# EasyEDA Pro project LuxcampBadge2025.epro, board LED
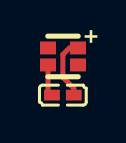
[diagram p5: board, top side]
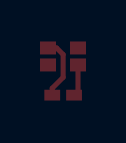
[diagram p6: board, bottom side, seen from below]

No outline. copper layers: Top Layer, Bottom Layer. Coordinates in mm from the lowest, leftmost part position.
Stack: Top Layer 0.035mm / Dielectric1 1.51mm FR4 er 4.5 / Bottom Layer 0.035mm

## Design rules (mm)
template: JLCPCB Capability(Two Layers Board)
spacing copperThickness1oz (default): track to track 0.102, other pairs 0.152 to 0.3
spacing copperThickness2oz: track to track 0.203, other pairs 0.152 to 0.3
track width copperThickness1oz (default): min 0.127, default 0.254, max 2.54
track width copperThickness2oz: min 0.203, default 0.254, max 2.54
differential pair differentialPair (default): width min 0.127, default 0.254, max 2.54; gap min 0.152, default 0.152
via viaSize (default): diameter min 0.5, default 0.61, max 10; hole min 0.3, default 0.305, max 6.3

## Placement (name value [footprint] x y rotation side)
C1  100nF  [C0402]  0 0 180 top
LED1  XL-1615RGBC-WS2812B-S  [LED-SMD_4P-L1.6-W1.5_XL-1615RGBC-WS2812B-S]  0.01 1.94 0 top

## Footprints (pads in the part's own frame, mm; a bottom-side part is the same pattern mirrored in y, then rotated)
C0402
  rect 0.79x0.54 smd: 1(-0.545,0) 2(0.545,0)
LED-SMD_4P-L1.6-W1.5_XL-1615RGBC-WS2812B-S
  rect 0.8x0.65 smd: 1(-0.75,0.425) 2(0.75,0.425) 3(-0.75,-0.425) 4(0.75,-0.425)

## Nets
GND: C1.2 LED1.3
LED_IN: LED1.4
LED_OUT: LED1.1
LED_VCC: C1.1 LED1.2

## Routing (per net, layer and track width the routed paths; a pad name or vN(x,y) marks a point on that pad's centre or on a via; arc(x,y) is an arc through that point)
GND: length 1.6
  Top Layer w0.254: C1.2 -0.74,0.2 LED1.3
LED_VCC: length 3.2
  Top Layer w0.254: LED1.2 0.33,2.36 0,2.03 0,0.89 0.54,0.34 C1.1
